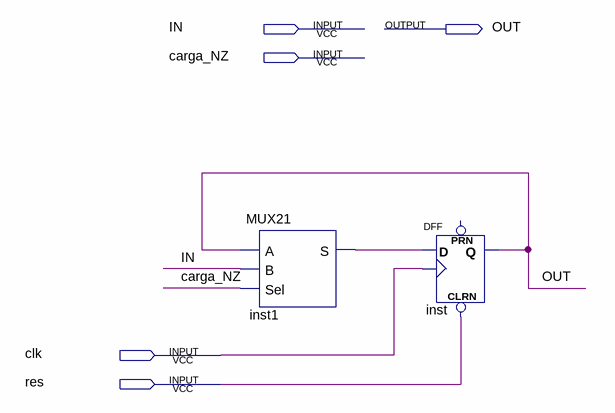
[diagram p0: schematic sheet]
// Quartus schematic RegNZ.bdf as structural Verilog: 2 symbols, 5 pins
module RegNZ (
  input  IN,
  input  carga_NZ,
  input  clk,
  input  res,
  output OUT
);

  wire inst1_s;

  MUX21 inst1 (.A(OUT), .B(IN), .Sel(carga_NZ), .S(inst1_s));
  DFF inst (.CLRN(res), .CLK(clk), .D(inst1_s), .Q(OUT));  // open: PRN
endmodule
